# Altium schematic sheet Processor.SchDoc
size A4; SheetNumber: 2; SheetTotal: 7; SPICEModelCacheYJUROCZO: <root> / <DocumentId>YJUROCZO</DocumentId> / <CacheFrame Number="0"> / <Model Name="umk107bj105_a-t" Kind="CKT"> / <Text>* UMK107BJ105_A-T     SPICE MODEL  ( General Type ) / *-------------------------------------------------------------------------------------------------------- / * Model Generated by TAIYO YUDEN Corporation (http://www.ty-top.com) / * Version 1.0 / * TAIYO YUDEN Control No. 170508_130520 / * Copyright(c) 2012 TAIYO YUDEN CO.,LTD. All Rights Reserved. / *-------------------------------------------------------------------------------------------------------- / * / * Products Name : Multilayer Ceramic Capacitors / * / * Characteristics : / *     Capacitance : 1 uF , Rated Voltage : 50V , TCC : X5R / *     Case Size : 1.6 x 0.8 / 0.063 x 0.031 [mm/inch] , Thickness : 0.8 / 0.031 [mm/inch] / *     (Conditions: Temperature = 25 degC , DC Bias Current/Voltage = 0A / 0V) / * / * Frequency Range : 40Hz - 3GHz / * / * External Node Assignments : / * / *  1  o---| |---o  2 / * / *-------------------------------------------------------------------------------------------------------- / .SubCkt UMK107BJ105_A-T 1 2 / **************************** / C0 1 110 0.79929u / Cm 1 101 0.13681u / C1 101 102 0.26224u / Rc1 101 102 5.8806k / C2 102 103 0.057839u / Rc2 102 103 469.42 / C3 103 110 0.014568u / Rc3 103 110 14.853 / C2m 1 301 0.13283u / C21 301 302 1.2593u / Rc21 301 302 6.3079k / C22 302 303 1.1189u / Rc22 302 303 6.9405k / C23 303 304 1.1421u / Rc23 303 304 6.4848k / C24 304 305 0.36861u / Rc24 304 305 785 / C25 305 306 0.39327u / Rc25 305 306 637.41 / C26 306 307 0.27451u / Rc26 306 307 19.365 / C27 307 308 0.15295u / Rc27 307 308 23.239 / C28 308 309 0.17569u / Rc28 308 309 17.788 / C29 309 110 1420.6p / Rc29 309 110 1.9725 / Rp0 1 110 500Meg / L0 110 120 0.24088n / Lm 120 130 0.1369n / L1 120 121 0.1842n / RL1 121 130 0.29804 / L2 120 122 0.40657n / RL2 122 130 0.57395 / L3 120 123 0.85773n / RL3 123 130 0.82282 / CR 120 124 0.11463u / LR 124 125 0.25983n / RR 125 130 52.447m / CL 130 140 1.4637p / LL 130 140 0.23986n / RL 130 140 33.985 / Rs 140 2 6.8539m / **************************** / .ends UMK107BJ105_A-T</Text> / </Model> / </CacheFrame> / </root>
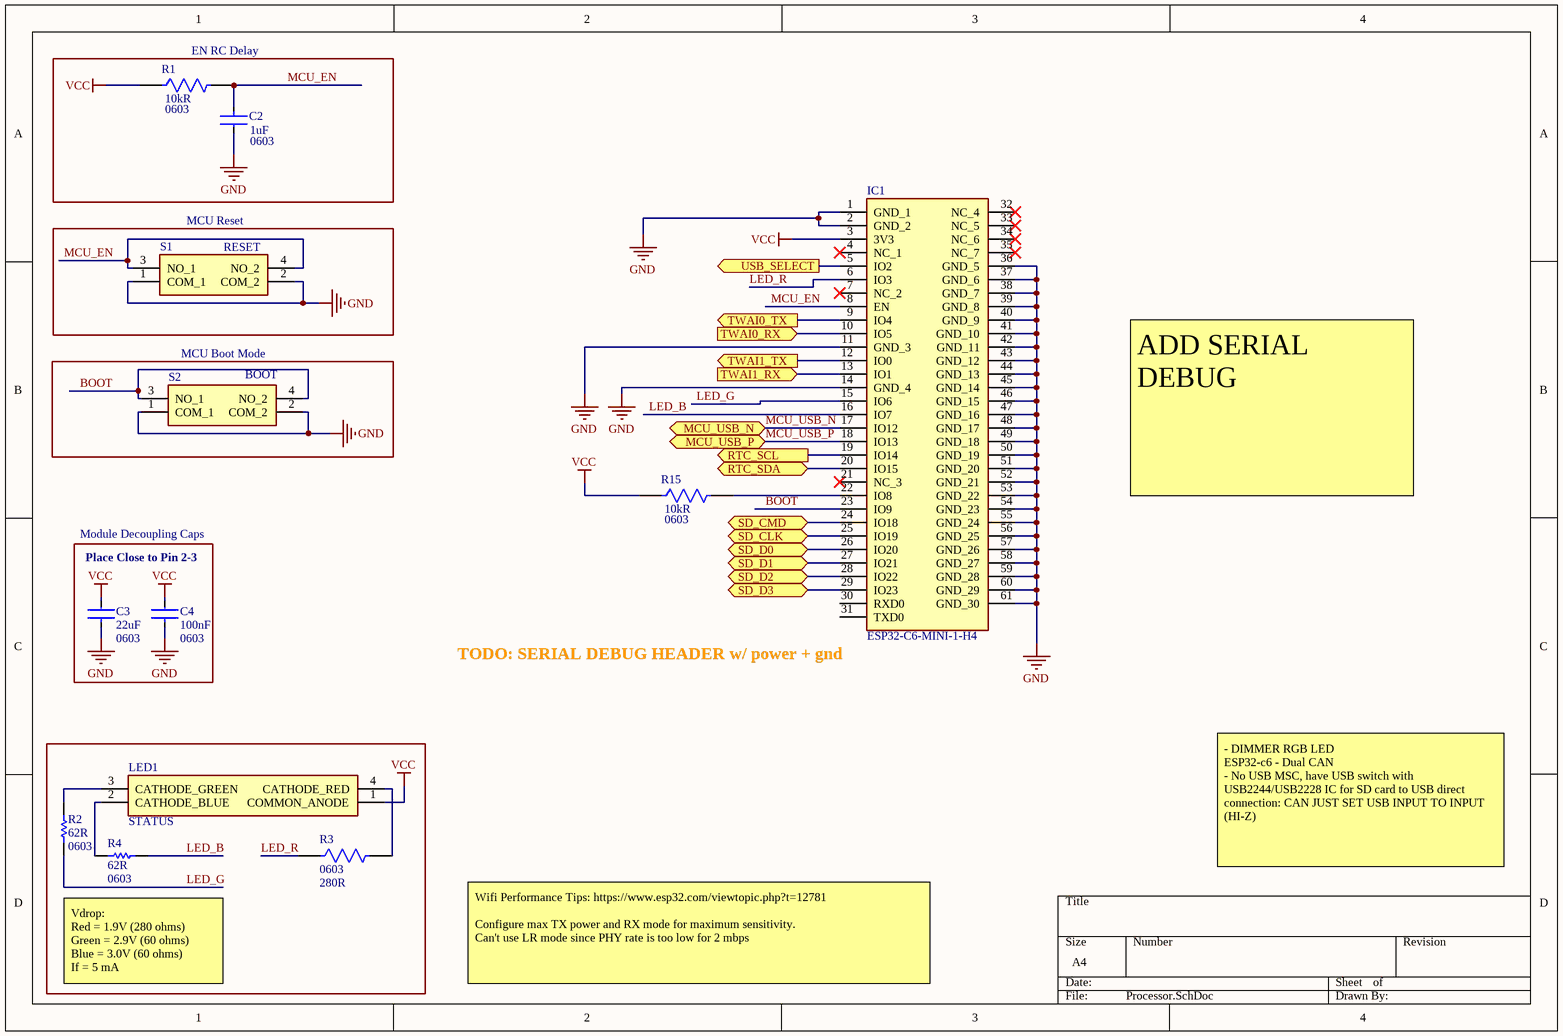
[diagram p0: Processor.SchDoc]

## Parts
C2  Case/Package: 0603  Capacitance: 1uF  [FP-0603-L_1_6_0_1-W_0_8_0-IPC_A]  (hidden comment: UMK107BJ105KA-T)
C3  Capacitance: 22uF  Case Code (Imperial): 0603  [FP-GRM188-0_2-IPC_C]  (hidden comment: GRM188R61A226ME15D)
C4  Capacitance: 100nF  Case/Package: 0603  [FP-CL10-IPC_A]  (hidden comment: CL10B104KB8WPNC)
IC1  ESP32-C6-MINI-1-H4  [ESP32C6MINI1H4]
LED1  STATUS  [CLMVCFKACL1D1L71BB7C3C3]
R1  Case Code (Imperial): 0603  Resistance: 10kR  [FP-RMCF0603-MFG]  (hidden comment: RMCF0603JG10K0)
R2  Resistance: 62R  Package: 0603  [RESC1608X55X30ML15T15]  (hidden comment: ERJ-3GEYJ620V)
R3  Case/Package: 0603  Resistance: 280R  [FP-RMCF0603-MFG]  (hidden comment: RMCF0603FT280R)
R4  Resistance: 62R  Package: 0603  [RESC1608X55X30ML15T15]  (hidden comment: ERJ-3GEYJ620V)
R15  Case Code (Imperial): 0603  Resistance: 10kR  [FP-RMCF0603-MFG]  (hidden comment: RMCF0603JG10K0)
S1  RESET  [PTS526SM15SMTR2LFS]
S2  BOOT  [PTS526SM15SMTR2LFS]

## Blocks framed on the sheet
EN RC Delay: C2 R1
MCU Reset: S1
MCU Boot Mode: S2

## Ports
MCU_USB_N (bidir), MCU_USB_P (bidir), RTC_SCL (out), RTC_SDA (bidir), SD_CLK (bidir), SD_CMD (bidir), SD_D0 (bidir), SD_D1 (bidir), SD_D2 (bidir), SD_D3 (bidir), TWAI0_RX (in), TWAI0_TX (out), TWAI1_RX (in), TWAI1_TX (out), USB_SELECT (out)

## Nets
GND: C2.2 C3.1 C4.1 IC1.1(GND_1) IC1.2(GND_2) IC1.11(GND_3) IC1.14(GND_4) IC1.36(GND_5) IC1.37(GND_6) IC1.38(GND_7) IC1.39(GND_8) IC1.40(GND_9) IC1.41(GND_10) IC1.42(GND_11) IC1.43(GND_12) IC1.44(GND_13) IC1.45(GND_14) IC1.46(GND_15) IC1.47(GND_16) IC1.48(GND_17) IC1.49(GND_18) IC1.50(GND_19) IC1.51(GND_20) IC1.52(GND_21) IC1.53(GND_22) IC1.54(GND_23) IC1.55(GND_24) IC1.56(GND_25) IC1.57(GND_26) IC1.58(GND_27) IC1.59(GND_28) IC1.60(GND_29) IC1.61(GND_30) S1.1(COM_1) S1.2(COM_2) S2.1(COM_1) S2.2(COM_2)
VCC: C3.2 C4.2 IC1.3(3V3) LED1.1(COMMON_ANODE) R1.1 R15.1
BOOT: IC1.23(IO9) S2.3(NO_1) S2.4(NO_2)
LED_B: IC1.16(IO7) R4.2
LED_G: IC1.15(IO6) R2.2
LED_R: IC1.6(IO3) R3.1
MCU_EN: C2.1 IC1.8(EN) R1.2 S1.3(NO_1) S1.4(NO_2)
MCU_USB_N: IC1.17(IO12) ; port MCU_USB_N
MCU_USB_P: IC1.18(IO13) ; port MCU_USB_P
RTC_SCL: IC1.19(IO14) ; port RTC_SCL
RTC_SDA: IC1.20(IO15) ; port RTC_SDA
SD_CLK: IC1.25(IO19) ; port SD_CLK
SD_CMD: IC1.24(IO18) ; port SD_CMD
SD_D0: IC1.26(IO20) ; port SD_D0
SD_D1: IC1.27(IO21) ; port SD_D1
SD_D2: IC1.28(IO22) ; port SD_D2
SD_D3: IC1.29(IO23) ; port SD_D3
TWAI0_RX: IC1.10(IO5) ; port TWAI0_RX
TWAI0_TX: IC1.9(IO4) ; port TWAI0_TX
TWAI1_RX: IC1.13(IO1) ; port TWAI1_RX
TWAI1_TX: IC1.12(IO0) ; port TWAI1_TX
USB_SELECT: IC1.5(IO2) ; port USB_SELECT
NetIC1_22: IC1.22(IO8) R15.2
NetLED1_2: LED1.2(CATHODE_BLUE) R4.1
NetLED1_3: LED1.3(CATHODE_GREEN) R2.1
NetLED1_4: LED1.4(CATHODE_RED) R3.2

Not connected (* = marked no-connect by the designer): IC1 4(NC_1)* 7(NC_2)* 21(NC_3)* 30(RXD0) 31(TXD0) 32(NC_4)* 33(NC_5)* 34(NC_6)* 35(NC_7)*

## Notes on the sheet
- ADD SERIAL DEBUG
- Module Decoupling Caps
- Place Close to Pin 2-3
- TODO: SERIAL DEBUG HEADER w/ power + gnd
- - DIMMER RGB LED
  ESP32-c6 - Dual CAN
  - No USB MSC, have USB switch with USB2244/USB2228 IC for SD card to USB direct connection: CAN JUST SET USB INPUT TO INPUT (HI-Z)
- Vdrop:
  Red = 1.9V (280 ohms)
  Green = 2.9V (60 ohms)
  Blue = 3.0V (60 ohms)
  If = 5 mA
- Wifi Performance Tips: https://www.esp32.com/viewtopic.php?t=12781
  Configure max TX power and RX mode for maximum sensitivity.
  Can't use LR mode since PHY rate is too low for 2 mbps

## Library data of the parts
C2 = CMP-2000-05447-3: None; Tolerance: 10%; Voltage Rating: 50V; Dielectric: X5R; Height: 0.8mm; Depth: 0.8mm; Number of Pins: 2; Length: 1.6mm; Thickness: 0.035inch; Contact Plating: Nickel; Radiation Hardening: No; Package Quantity: 1; Halogen Free: Halogen Free; RoHS Compliant: Yes; Termination: SMD/SMT; Max Operating Temperature: 85°C; Min Operating Temperature: -55°C; Case Code (Metric): 1608; Construction: Flat; Voltage Rating (DC): 50V; Packaging: Tape and Reel; Series: M; Case Code (Imperial): 0603; Width: 0.031inch; Mount: Surface Mount
C3 = CMP-2000-06337-3: Chip Multilayer Ceramic Capacitors for General Purpose, 0603, 22uF, X5R, 15%, 20%, 10V; Tolerance: 20%; Weight: 0.000222oz; Material: Ceramic; Depth: 0.8mm; Length: 1.6mm; Termination: SMD/SMT; Packaging: Tape and Reel; Width: 0.8mm; Voltage Rating: 10V; Mount: Surface Mount; Voltage Rating (DC): 10V; Case/Package: 0603; Thickness: 0.039inch; REACH SVHC: No SVHC; Dielectric: X5R; Height: 0.8mm; Package Quantity: 4000; Case Code (Metric): 1608; Min Operating Temperature: -55°C; Lead Free: Lead Free; Max Operating Temperature: 85°C
C4 = CMP-13271-002353-1: Cap Ceramic 100nF 50V X7R ±10% Pad SMD 0603 +125°C T/R; Ratings: AEC-Q200; Features: Soft Termination; Max Operating Temperature: 125°C; Mount: Surface Mount; Width: 0.031inch; Voltage Rating: 50V; Case Code (Metric): 1608; Case Code (Imperial): 0603; Tolerance: 10%; Min Operating Temperature: -55°C; Thickness: 0.035inch; Lead Free: Lead Free; Packaging: Tape and Reel; Length: 0.063inch
IC1 = ESP32-C6-MINI-1-H4: Integrated Circuit; Manufacturer_Name: Espressif Systems; Datasheet Link: https://www.espressif.com/sites/default/files/documentation/esp32-c6-mini-1_mini-1u_datasheet_en.pdf; Height: 2.55mm; Manufacturer_Part_Number: ESP32-C6-MINI-1-H4; Mouser Part Number: 356-ESP32C6MINI1-H4; Mouser Price/Stock: https://www.mouser.co.uk/ProductDetail/Espressif-Systems/ESP32-C6-MINI-1-H4?qs=Jm2GQyTW%2Fbgg5ClQiAJNHw%3D%3D
LED1 = CLMVC-FKA-CL1D1L71BB7C3C3: LED; Manufacturer_Name: Wolfspeed; Datasheet Link: https://www.cree.com/led-components/media/documents/1273-CLMVC-FKA.pdf; Height: 1mm; Manufacturer_Part_Number: CLMVC-FKA-CL1D1L71BB7C3C3; Mouser Part Number: 941-CLMVCFKACL1D1L71; Mouser Price/Stock: https://www.mouser.co.uk/ProductDetail/Cree-LED/CLMVC-FKA-CL1D1L71BB7C3C3?qs=fSnNYG2PaKLJAXXrLOgMiQ%3D%3D; Arrow Part Number: CLMVC-FKA-CL1D1L71BB7C3C3; Arrow Price/Stock: https://www.arrow.com/en/products/clmvc-fka-cl1d1l71bb7c3c3/cree-led?region=nac
R1 R15 = CMP-26527-000153-1: 10kΩ ±5% 0.1W 0603 Thick Film Chip Resistor AEC-Q200 compliant; Temperature Coefficient: 200ppm/°C; Max Power Dissipation: 100mW; Tolerance: 5%; Series: RMCF; Resistor Type: Thick Film; Length: 0.061inch; Features: Automotive AEC-Q200; Height: 0.022inch; Case Code (Metric): 1608; Width: 0.031inch; Number of Terminations: 2; Contact Plating: Tin; Case/Package: 0603; Package Quantity: 1; Max Operating Temperature: 155°C; Mount: Surface Mount; RoHS Compliant: Yes; Radiation Hardening: No; Min Operating Temperature: -55°C; Packaging: Tape and Reel
R2 R4 = CMP-1012-00045-2: Manufacturer: Panasonic; Part Number: ERJ-3GEYJ620V
R3 = CMP-26527-006784-1: 280Ω ±1% 0.1W 0603 Thick Film Chip Resistor AEC-Q200 compliant; Max Power Dissipation: 100mW; Temperature Coefficient: 100ppm/°C; RoHS Compliant: Yes; Height: 0.022inch; Resistor Type: Thick Film; Case Code (Metric): 1608; Radiation Hardening: No; Contact Plating: Tin; Series: RMCF; Features: Automotive AEC-Q200; Number of Terminations: 2; Tolerance: 1%; Packaging: Tape and Reel; Max Operating Temperature: 155°C; Min Operating Temperature: -55°C; Length: 0.061inch; Lead Free: Lead Free; Width: 0.031inch; Mount: Surface Mount; Case Code (Imperial): 0603
S1 S2 = PTS526_SM15_SMTR2_LFS: Switch; Manufacturer_Name: C & K COMPONENTS; Manufacturer_Part_Number: PTS526 SM15 SMTR2 LFS; Datasheet Link: https://www.mouser.com/datasheet/2/60/pts526-1651200.pdf; Height: 1.5mm; Mouser Part Number: 611-PTS526SM15SMTR2L; Mouser Price/Stock: https://www.mouser.co.uk/ProductDetail/CK/PTS526-SM15-SMTR2-LFS?qs=UXgszm6BlbENivbslIA%252B5g%3D%3D; Arrow Part Number: PTS526 SM15 SMTR2 LFS; Arrow Price/Stock: https://www.arrow.com/en/products/pts526-sm15-smtr2-lfs/ck?region=nac